# Altium schematic sheet MB_ddr.SchDoc: Материнская плата
size 420 x 297 mm; DrawnBy: В.Титов; DocumentNumber: ХХХХ.468179.001 Э3; SheetNumber: 3; SheetTotal: 7; DocumentType: Схема электрическая принципиальная; Title2: Питание процессора
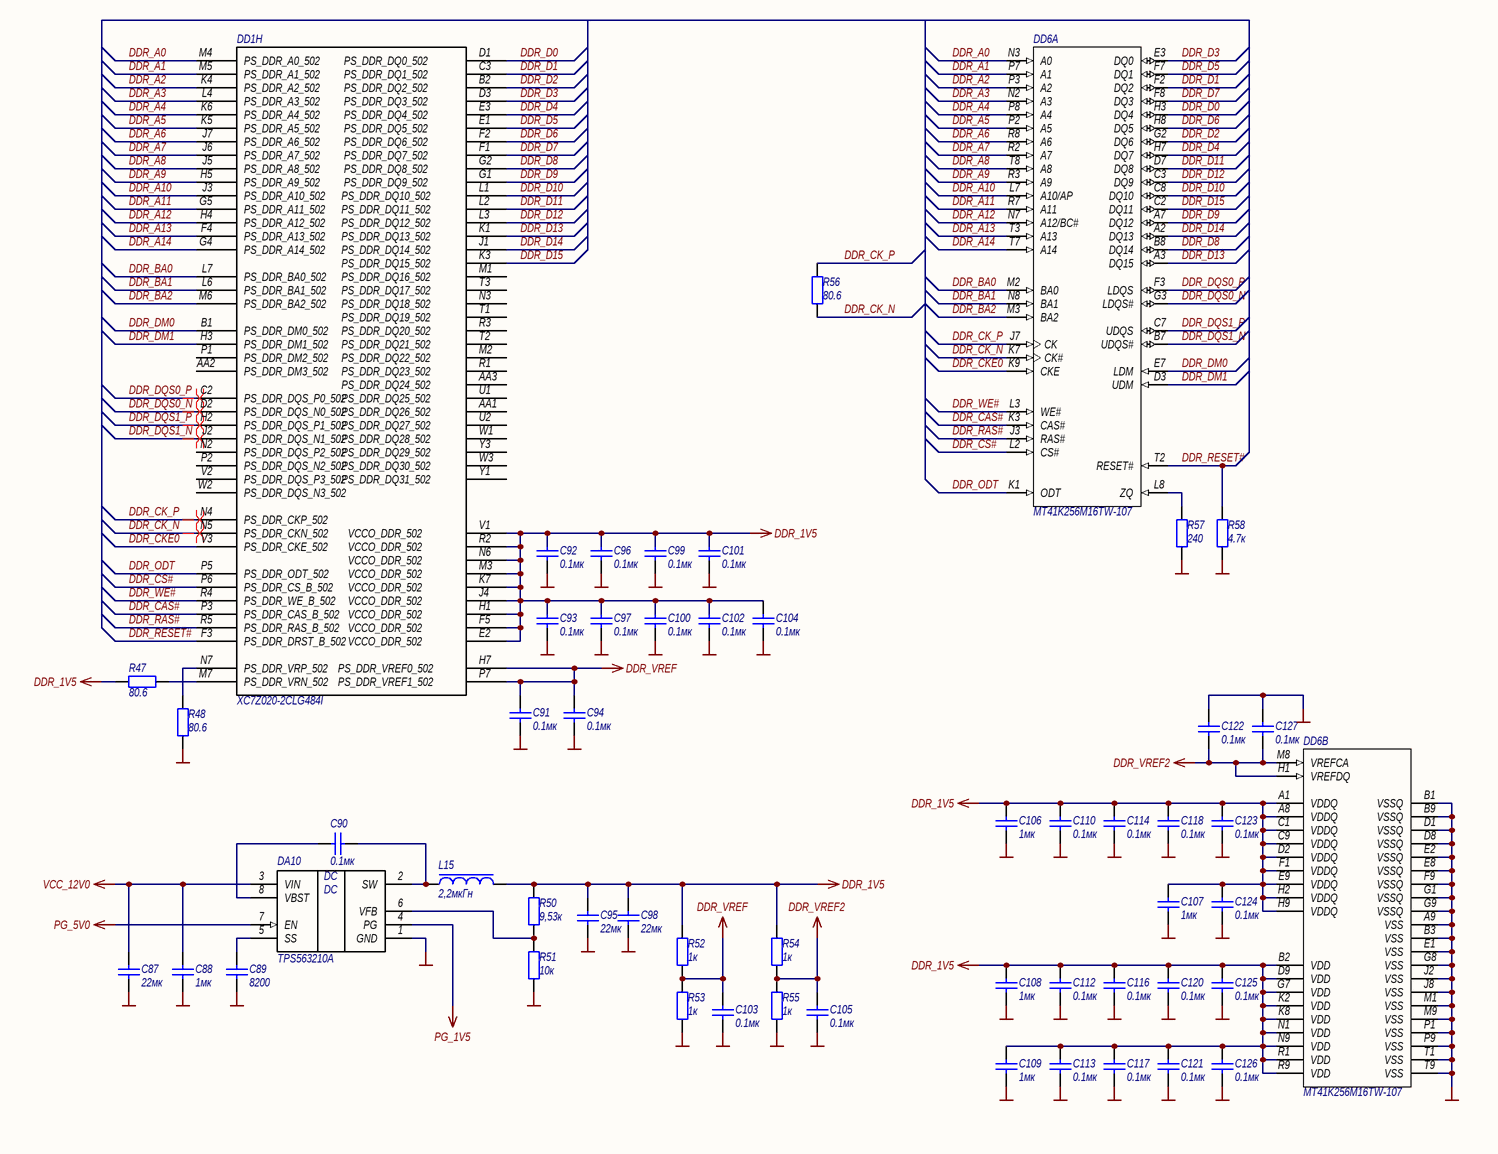
[diagram p0: MB_ddr.SchDoc]

## Parts
C87  22мк  [CAPC2012X12L]
C88  1мк  [CAPC1005X06N]
C89  8200  [CAPC1005X06N]
C90  0.1мк  [CAPC1005X06N]
C91  0.1мк  [CAPC1005X06N]
C92  0.1мк  [CAPC1005X06N]
C93  0.1мк  [CAPC1005X06N]
C94  0.1мк  [CAPC1005X06N]
C95  22мк  [CAPC2012X12L]
C96  0.1мк  [CAPC1005X06N]
C97  0.1мк  [CAPC1005X06N]
C98  22мк  [CAPC2012X12L]
C99  0.1мк  [CAPC1005X06N]
C100  0.1мк  [CAPC1005X06N]
C101  0.1мк  [CAPC1005X06N]
C102  0.1мк  [CAPC1005X06N]
C103  0.1мк  [CAPC1005X06N]
C104  0.1мк  [CAPC1005X06N]
C105  0.1мк  [CAPC1005X06N]
C106  1мк  [CAPC1005X06N]
C107  1мк  [CAPC1005X06N]
C108  1мк  [CAPC1005X06N]
C109  1мк  [CAPC1005X06N]
C110  0.1мк  [CAPC1005X06N]
C112  0.1мк  [CAPC1005X06N]
C113  0.1мк  [CAPC1005X06N]
C114  0.1мк  [CAPC1005X06N]
C116  0.1мк  [CAPC1005X06N]
C117  0.1мк  [CAPC1005X06N]
C118  0.1мк  [CAPC1005X06N]
C120  0.1мк  [CAPC1005X06N]
C121  0.1мк  [CAPC1005X06N]
C122  0.1мк  [CAPC1005X06N]
C123  0.1мк  [CAPC1005X06N]
C124  0.1мк  [CAPC1005X06N]
C125  0.1мк  [CAPC1005X06N]
C126  0.1мк  [CAPC1005X06N]
C127  0.1мк  [CAPC1005X06N]
DA10  TPS563210A  [TSOP65P280X110-8N]
DD1  XC7Z020-2CLG484I  [BGA484C80P22X22_1900X1900X160]  (part H of 9)
DD6  MT41K256M16TW-107  [BGA96C80P9X16_800X1400X110]  (parts A,B of 2)
L15  2,2мкГн  [CSAB0420]
R47  80.6  [RESC1005X06N]
R48  80.6  [RESC1005X06N]
R50  9,53к  [RESC1005X06N]
R51  10к  [RESC1005X06N]
R52  1к  [RESC1005X06N]
R53  1к  [RESC1005X06N]
R54  1к  [RESC1005X06N]
R55  1к  [RESC1005X06N]
R56  80.6  [RESC1005X06N]
R57  240  [RESC1005X06N]
R58  4.7к  [RESC1005X06N]

## Nets
DDR_1V5: C92.2 C93.2 C95.2 C96.2 C97.2 C98.2 C99.2 C100.2 C101.2 C102.2 C104.2 C106.2 C107.2 C108.2 C109.2 C110.2 C112.2 C113.2 C114.2 C116.2 C117.2 C118.2 C120.2 C121.2 C123.2 C124.2 C125.2 C126.2 DD1.E2(VCCO_DDR_502) DD1.F5(VCCO_DDR_502) DD1.H1(VCCO_DDR_502) DD1.J4(VCCO_DDR_502) DD1.K7(VCCO_DDR_502) DD1.M3(VCCO_DDR_502) DD1.N6(VCCO_DDR_502) DD1.R2(VCCO_DDR_502) DD1.V1(VCCO_DDR_502) DD6.A1(VDDQ) DD6.A8(VDDQ) DD6.B2(VDD) DD6.C1(VDDQ) DD6.C9(VDDQ) DD6.D2(VDDQ) DD6.D9(VDD) DD6.E9(VDDQ) DD6.F1(VDDQ) DD6.G7(VDD) DD6.H2(VDDQ) DD6.H9(VDDQ) DD6.K2(VDD) DD6.K8(VDD) DD6.N1(VDD) DD6.N9(VDD) DD6.R1(VDD) DD6.R9(VDD) L15.2 R47.2 R50.2 R52.1 R54.1
DDR_VREF: C91.2 C94.2 C103.2 DD1.H7(PS_DDR_VREF0_502) DD1.P7(PS_DDR_VREF1_502) R52.2 R53.1
DDR_VREF2: C105.2 C122.1 C127.1 DD6.H1(VREFDQ) DD6.M8(VREFCA) R54.2 R55.1
GND: C87.1 C88.1 C89.1 C91.1 C92.1 C93.1 C94.1 C95.1 C96.1 C97.1 C98.1 C99.1 C100.1 C101.1 C102.1 C103.1 C104.1 C105.1 C106.1 C107.1 C108.1 C109.1 C110.1 C112.1 C113.1 C114.1 C116.1 C117.1 C118.1 C120.1 C121.1 C122.2 C123.1 C124.1 C125.1 C126.1 C127.2 DA10.1(GND) DD6.A9(VSS) DD6.B1(VSSQ) DD6.B3(VSS) DD6.B9(VSSQ) DD6.D1(VSSQ) DD6.D8(VSSQ) DD6.E1(VSS) DD6.E2(VSSQ) DD6.E8(VSSQ) DD6.F9(VSSQ) DD6.G1(VSSQ) DD6.G8(VSS) DD6.G9(VSSQ) DD6.J2(VSS) DD6.J8(VSS) DD6.M1(VSS) DD6.M9(VSS) DD6.P1(VSS) DD6.P9(VSS) DD6.T1(VSS) DD6.T9(VSS) R48.2 R51.2 R53.2 R55.2 R57.2 R58.2
PG_1V5: DA10.4(PG)
PG_5V0: DA10.7(EN)
VCC_12V0: C87.2 C88.2 DA10.3(VIN)
DDR_A0: DD1.M4(PS_DDR_A0_502) DD6.N3(A0)
DDR_A1: DD1.M5(PS_DDR_A1_502) DD6.P7(A1)
DDR_A2: DD1.K4(PS_DDR_A2_502) DD6.P3(A2)
DDR_A3: DD1.L4(PS_DDR_A3_502) DD6.N2(A3)
DDR_A4: DD1.K6(PS_DDR_A4_502) DD6.P8(A4)
DDR_A5: DD1.K5(PS_DDR_A5_502) DD6.P2(A5)
DDR_A6: DD1.J7(PS_DDR_A6_502) DD6.R8(A6)
DDR_A7: DD1.J6(PS_DDR_A7_502) DD6.R2(A7)
DDR_A8: DD1.J5(PS_DDR_A8_502) DD6.T8(A8)
DDR_A9: DD1.H5(PS_DDR_A9_502) DD6.R3(A9)
DDR_A10: DD1.J3(PS_DDR_A10_502) DD6.L7(A10/AP)
DDR_A11: DD1.G5(PS_DDR_A11_502) DD6.R7(A11)
DDR_A12: DD1.H4(PS_DDR_A12_502) DD6.N7(A12/BC#)
DDR_A13: DD1.F4(PS_DDR_A13_502) DD6.T3(A13)
DDR_A14: DD1.G4(PS_DDR_A14_502) DD6.T7(A14)
DDR_BA0: DD1.L7(PS_DDR_BA0_502) DD6.M2(BA0)
DDR_BA1: DD1.L6(PS_DDR_BA1_502) DD6.N8(BA1)
DDR_BA2: DD1.M6(PS_DDR_BA2_502) DD6.M3(BA2)
DDR_CAS#: DD1.P3(PS_DDR_CAS_B_502) DD6.K3(CAS#)
DDR_CK_N: DD1.N5(PS_DDR_CKN_502) DD6.K7(CK#) R56.2
DDR_CK_P: DD1.N4(PS_DDR_CKP_502) DD6.J7(CK) R56.1
DDR_CKE0: DD1.V3(PS_DDR_CKE_502) DD6.K9(CKE)
DDR_CS#: DD1.P6(PS_DDR_CS_B_502) DD6.L2(CS#)
DDR_D0: DD1.D1(PS_DDR_DQ0_502) DD6.H3(DQ4)
DDR_D1: DD1.C3(PS_DDR_DQ1_502) DD6.F2(DQ2)
DDR_D2: DD1.B2(PS_DDR_DQ2_502) DD6.G2(DQ6)
DDR_D3: DD1.D3(PS_DDR_DQ3_502) DD6.E3(DQ0)
DDR_D4: DD1.E3(PS_DDR_DQ4_502) DD6.H7(DQ7)
DDR_D5: DD1.E1(PS_DDR_DQ5_502) DD6.F7(DQ1)
DDR_D6: DD1.F2(PS_DDR_DQ6_502) DD6.H8(DQ5)
DDR_D7: DD1.F1(PS_DDR_DQ7_502) DD6.F8(DQ3)
DDR_D8: DD1.G2(PS_DDR_DQ8_502) DD6.B8(DQ14)
DDR_D9: DD1.G1(PS_DDR_DQ9_502) DD6.A7(DQ12)
DDR_D10: DD1.L1(PS_DDR_DQ10_502) DD6.C8(DQ10)
DDR_D11: DD1.L2(PS_DDR_DQ11_502) DD6.D7(DQ8)
DDR_D12: DD1.L3(PS_DDR_DQ12_502) DD6.C3(DQ9)
DDR_D13: DD1.K1(PS_DDR_DQ13_502) DD6.A3(DQ15)
DDR_D14: DD1.J1(PS_DDR_DQ14_502) DD6.A2(DQ13)
DDR_D15: DD1.K3(PS_DDR_DQ15_502) DD6.C2(DQ11)
DDR_DM0: DD1.B1(PS_DDR_DM0_502) DD6.E7(LDM)
DDR_DM~{1}: DD1.H3(PS_DDR_DM1_502) DD6.D3(UDM)
DDR_DQS0_N: DD1.D2(PS_DDR_DQS_N0_502) DD6.G3(LDQS#)
DDR_DQS0_P: DD1.C2(PS_DDR_DQS_P0_502) DD6.F3(LDQS)
DDR_DQS1_N: DD1.J2(PS_DDR_DQS_N1_502) DD6.B7(UDQS#)
DDR_DQS1_P: DD1.H2(PS_DDR_DQS_P1_502) DD6.C7(UDQS)
DDR_ODT: DD1.P5(PS_DDR_ODT_502) DD6.K1(ODT)
DDR_RAS#: DD1.R5(PS_DDR_RAS_B_502) DD6.J3(RAS#)
DDR_RESET#: DD1.F3(PS_DDR_DRST_B_502) DD6.T2(RESET#) R58.1
DDR_WE#: DD1.R4(PS_DDR_WE_B_502) DD6.L3(WE#)
NetC89_2: C89.2 DA10.5(SS)
NetC90_1: C90.1 DA10.2(SW) L15.1
NetC90_2: C90.2 DA10.8(VBST)
NetDA10_6: DA10.6(VFB) R50.1 R51.1
NetDD1_M7    : DD1.M7(PS_DDR_VRN_502) R47.1
NetDD1_N7    : DD1.N7(PS_DDR_VRP_502) R48.1
NetDD6_L8: DD6.L8(ZQ) R57.1

Not connected (* = marked no-connect by the designer): DD1 AA1   (PS_DDR_DQ26_502__________) AA2   (PS_DDR_DM3_502___________) AA3   (PS_DDR_DQ24_502__________) M1    (PS_DDR_DQ16_502__________) M2    (PS_DDR_DQ22_502__________) N2    (PS_DDR_DQS_P2_502________) N3    (PS_DDR_DQ18_502__________) P1    (PS_DDR_DM2_502___________) P2    (PS_DDR_DQS_N2_502________) R1    (PS_DDR_DQ23_502__________) R3    (PS_DDR_DQ20_502__________) T1    (PS_DDR_DQ19_502__________) T2    (PS_DDR_DQ21_502__________) T3    (PS_DDR_DQ17_502__________) U1    (PS_DDR_DQ25_502__________) U2    (PS_DDR_DQ27_502__________) V2    (PS_DDR_DQS_P3_502________) W1    (PS_DDR_DQ28_502__________) W2    (PS_DDR_DQS_N3_502________) W3    (PS_DDR_DQ30_502__________) Y1    (PS_DDR_DQ31_502__________) Y3    (PS_DDR_DQ29_502__________)

## Layout directives
differential pair: DDR_CK_N, DDR_CK_P, DDR_DQS0_N, DDR_DQS0_P, DDR_DQS1_N, DDR_DQS1_P

## Notes on the sheet
- Перв. примен.
- Справ. №
- Подп. и дата
- Инв. № дубл.
- Взаим. инв. №
- Инв. № подл.
- Лист
- Изм.
- № докум.
- Подп.
- Дата
- Копировал
- Формат А3
- (in symbol Микросхема TPS563210A) DC

## Library data of the parts
C87 C95 C98 = Кер.ЧИП конд. 0805 22мкФ X5R 10% 16В: Кер. ЧИП-конденсатор; Manufacturer: TDK; ManufacturerPartNumber: C2012X5R1C226KT; Power/Voltage: 16В; TKE: X5R; Tolerance: ±10%; Value: 22мк
C88 C106-C109 = Кер.ЧИП конд. 0402 1мкФ X5R 10%, 10В: Кер. ЧИП-конденсатор; Power/Voltage: 10В; TKE: X5R; Tolerance: ±10%; PackageReference: 0402; Value: 1мк
C89 = Кер.ЧИП конд. 0402 8200пФ X7R 10%, 50В: Кер. ЧИП-конденсатор; Power/Voltage: 50В; TKE: X7R; Tolerance: ±20%; Value: 8200
C90-C94 C96 C97 C99-C105 C110 C112-C114 C116-C118 C120-C127 = Кер.ЧИП конд. 0402 0.1мкФ X7R 10%, 16В: Кер. ЧИП-конденсатор; Power/Voltage: 16В; TKE: X7R; Tolerance: ±10%; PackageReference: 0402; Value: 0.1мк
DA10 = Микросхема TPS563210A: TPS56x210A, 4.5-V to 17-V Input, 2-A, 3-A Synchrono; Manufacturer: TI; Value: TPS563210A
DD1 = Микросхема XC7Z020-2CLG484I: Zynq®-7000 SoC Family; Manufacturer: XILINX; Value: XC7Z020-2CLG484I; ComponentLink1Description: datasheet; ComponentLink1URL: https://www.xilinx.com/support/documentation/data_sheets/ds925-zynq-ultrascale-plus.pdf
DD6 = Микросхема MT41K256M16TW-107: 4Gb, x16, 1.35V DDR3L; Manufacturer: Micron; PartNumber: MT41K128M16JT-125; CL: CL = 13; Clock Rate: 667 MHz; Cycle Time: 1.07ns; Data Rate: DDR3-1866; Density: 2Gb; Op. Temp.: 0C to +95C; DatasheetVersion: Rev.F; PackageVersion: Rev.G; PackageReference: MICT-JT-96; PackageDescription: 96-Ball Fine-Pitch Ball Grid Array, 14 x 8 mm, Pitch 0.8 mm; Depth: 256M16; Package: FBGA; Pin Count: 96-ball; RoHS: Yes; Voltage: 1.35V; Width: x16; Mounting Technology: Surface Mount; ComponentLink1Description: Manufacturer URL; ComponentLink1URL: http://www.micron.com/; ComponentLink2Description: Datasheet; ComponentLink2URL: http://www.micron.com/~/media/Documents/Products/Data%20Sheet/DRAM/2Gb_DDR3_SDRAM.pdf; ComponentLink3Description: Package Specification; ComponentLink3URL: http://www.micron.com/~/media/Documents/Products/Data%20Sheet/DRAM/2Gb_DDR3_SDRAM.pdf; Value: MT41K256M16TW-107
L15 = ЧИП индуктивность CSAB0420-2R2M: Molding Power Choke; Manufacturer: Vishay; ManufacturerPartNumber: IHLP1616ABER1R0M11; Value: 2,2мкГн
R47 R48 R56 = Чип резистор 0402 80,6 Ом, 1%_1: ЧИП-резистор; Tolerance: ±1%; TKE: 100 ppm/°С; PackageReference: 0402; Value: 80.6
R50 = Чип резистор 0402 9,53 кОм, 1%: ЧИП-резистор; Tolerance: ±1%; TKE: 100 ppm/°С; PackageReference: 0402; Value: 9,53к
R51 = Чип резистор 0402 10 кОм, 1%: ЧИП-резистор; Tolerance: ±5%; TKE: 100 ppm/°С; PackageReference: 0402; Value: 10к
R52-R55 = Чип резистор 0402 1 кОм, 5%: ЧИП-резистор; Tolerance: ±5%; TKE: 100 ppm/°С; PackageReference: 0402; Value: 1к
R57 = Чип резистор 0402 240 Ом, 5%: ЧИП-резистор; Tolerance: ±5%; TKE: 100 ppm/°С; PackageReference: 0402; Value: 240
R58 = Чип резистор 0402 4,7 кОм, 5%: ЧИП-резистор; Tolerance: ±5%; TKE: 100 ppm/°С; PackageReference: 0402; Value: 4.7к